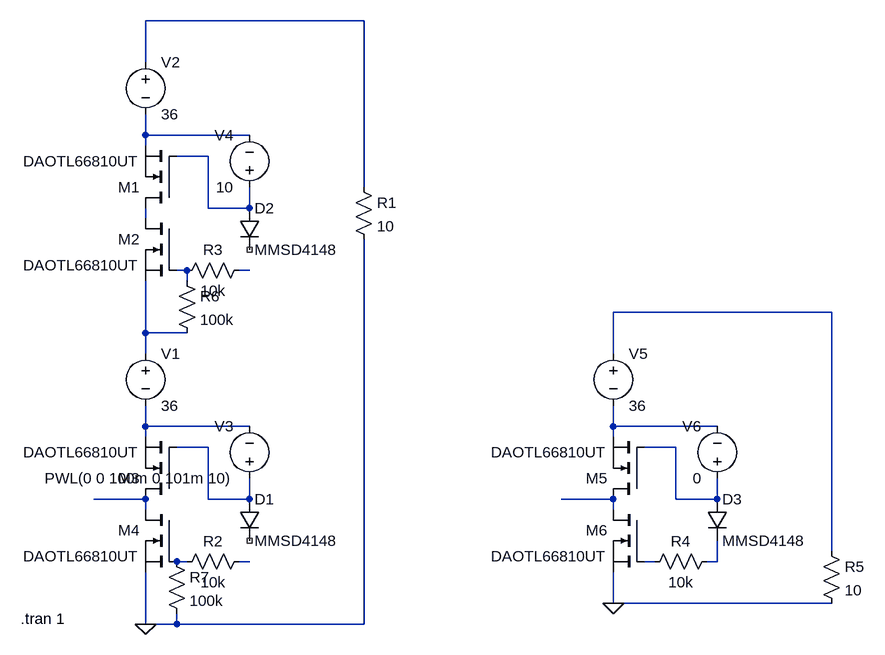
[diagram p0: schematic Draft8.asc]
Draft8.asc, the LTspice schematic file:
Version 4
SHEET 1 1256 680
WIRE 480 -416 144 -416
WIRE 144 -352 144 -416
WIRE 144 -240 144 -272
WIRE 304 -240 144 -240
WIRE 144 -224 144 -240
WIRE 240 -208 192 -208
WIRE 480 -160 480 -416
WIRE 240 -128 240 -208
WIRE 304 -128 304 -160
WIRE 304 -128 240 -128
WIRE 144 -112 144 -128
WIRE 208 -32 192 -32
WIRE 304 -32 288 -32
WIRE 208 -16 208 -32
WIRE 1200 32 864 32
WIRE 144 64 144 -16
WIRE 208 64 144 64
WIRE 144 96 144 64
WIRE 864 96 864 32
WIRE 144 208 144 176
WIRE 304 208 144 208
WIRE 864 208 864 176
WIRE 1024 208 864 208
WIRE 144 224 144 208
WIRE 864 224 864 208
WIRE 240 240 192 240
WIRE 960 240 912 240
WIRE 144 320 64 320
WIRE 240 320 240 240
WIRE 304 320 304 288
WIRE 304 320 240 320
WIRE 864 320 784 320
WIRE 960 320 960 240
WIRE 1024 320 1024 288
WIRE 1024 320 960 320
WIRE 144 336 144 320
WIRE 864 336 864 320
WIRE 1200 400 1200 32
WIRE 208 416 192 416
WIRE 304 416 288 416
WIRE 928 416 912 416
WIRE 1024 416 1024 384
WIRE 1024 416 1008 416
WIRE 864 480 864 432
WIRE 1200 480 864 480
WIRE 144 512 144 432
WIRE 192 512 192 496
WIRE 192 512 144 512
WIRE 480 512 480 -80
WIRE 480 512 192 512
FLAG 144 512 0
FLAG 864 480 0
SYMBOL voltage 144 80 R0
WINDOW 123 0 0 Left 0
WINDOW 39 0 0 Left 0
SYMATTR InstName V1
SYMATTR Value 36
SYMBOL voltage 144 -368 R0
WINDOW 123 0 0 Left 0
WINDOW 39 0 0 Left 0
SYMATTR InstName V2
SYMATTR Value 36
SYMBOL nmos 192 320 R180
SYMATTR InstName M3
SYMATTR Value DAOTL66810UT
SYMBOL nmos 192 336 M0
SYMATTR InstName M4
SYMATTR Value DAOTL66810UT
SYMBOL res 464 -176 R0
SYMATTR InstName R1
SYMATTR Value 10
SYMBOL voltage 304 304 R180
WINDOW 0 24 96 Left 2
WINDOW 3 24 16 Left 2
WINDOW 123 0 0 Left 0
WINDOW 39 0 0 Left 0
SYMATTR InstName V3
SYMATTR Value PWL(0 0 100m 0 101m 10)
SYMBOL diode 288 320 R0
SYMATTR InstName D1
SYMATTR Value MMSD4148
SYMBOL res 304 400 R90
WINDOW 0 0 56 VBottom 2
WINDOW 3 32 56 VTop 2
SYMATTR InstName R2
SYMATTR Value 10k
SYMBOL nmos 192 -128 R180
SYMATTR InstName M1
SYMATTR Value DAOTL66810UT
SYMBOL nmos 192 -112 M0
SYMATTR InstName M2
SYMATTR Value DAOTL66810UT
SYMBOL voltage 304 -144 R180
WINDOW 0 24 96 Left 2
WINDOW 3 24 16 Left 2
WINDOW 123 0 0 Left 0
WINDOW 39 0 0 Left 0
SYMATTR InstName V4
SYMATTR Value 10
SYMBOL diode 288 -128 R0
SYMATTR InstName D2
SYMATTR Value MMSD4148
SYMBOL res 304 -48 R90
WINDOW 0 0 56 VBottom 2
WINDOW 3 32 56 VTop 2
SYMATTR InstName R3
SYMATTR Value 10k
SYMBOL voltage 864 80 R0
WINDOW 123 0 0 Left 0
WINDOW 39 0 0 Left 0
SYMATTR InstName V5
SYMATTR Value 36
SYMBOL nmos 912 320 R180
SYMATTR InstName M5
SYMATTR Value DAOTL66810UT
SYMBOL nmos 912 336 M0
SYMATTR InstName M6
SYMATTR Value DAOTL66810UT
SYMBOL voltage 1024 304 R180
WINDOW 0 24 96 Left 2
WINDOW 3 24 16 Left 2
WINDOW 123 0 0 Left 0
WINDOW 39 0 0 Left 0
SYMATTR InstName V6
SYMATTR Value 0
SYMBOL diode 1008 320 R0
SYMATTR InstName D3
SYMATTR Value MMSD4148
SYMBOL res 1024 400 R90
WINDOW 0 0 56 VBottom 2
WINDOW 3 32 56 VTop 2
SYMATTR InstName R4
SYMATTR Value 10k
SYMBOL res 1184 384 R0
SYMATTR InstName R5
SYMATTR Value 10
SYMBOL res 192 -32 R0
SYMATTR InstName R6
SYMATTR Value 100k
SYMBOL res 176 400 R0
SYMATTR InstName R7
SYMATTR Value 100k
TEXT -48 504 Left 2 !.tran 1

The netlist it stands for:
* Draft8.asc
V1 N008 N009 36
V2 N001 N002 36
M3 N013 N011 N009 N009 DAOTL66810UT
M4 N013 N015 0 0 DAOTL66810UT
R1 N001 0 10
V3 N011 N009 PWL(0 0 100m 0 101m 10)
D1 N011 NC_01 MMSD4148
R2 N016 N015 10k
M1 N004 N003 N002 N002 DAOTL66810UT
M2 N004 N005 N008 N008 DAOTL66810UT
V4 N003 N002 10
D2 N003 NC_02 MMSD4148
R3 N006 N005 10k
V5 N007 N010 36
M5 N014 N012 N010 N010 DAOTL66810UT
M6 N014 N017 0 0 DAOTL66810UT
V6 N012 N010 0
D3 N012 N018 MMSD4148
R4 N018 N017 10k
R5 N007 0 10
R6 N005 N008 100k
R7 N015 0 100k
.model D D
.lib standard.dio
.model NMOS NMOS
.model PMOS PMOS
.lib standard.mos
.tran 1
.backanno
.end